# EAGLE schematic Sparkfun_LilyPad-Switched-Battery (EAGLE 7.5.0)
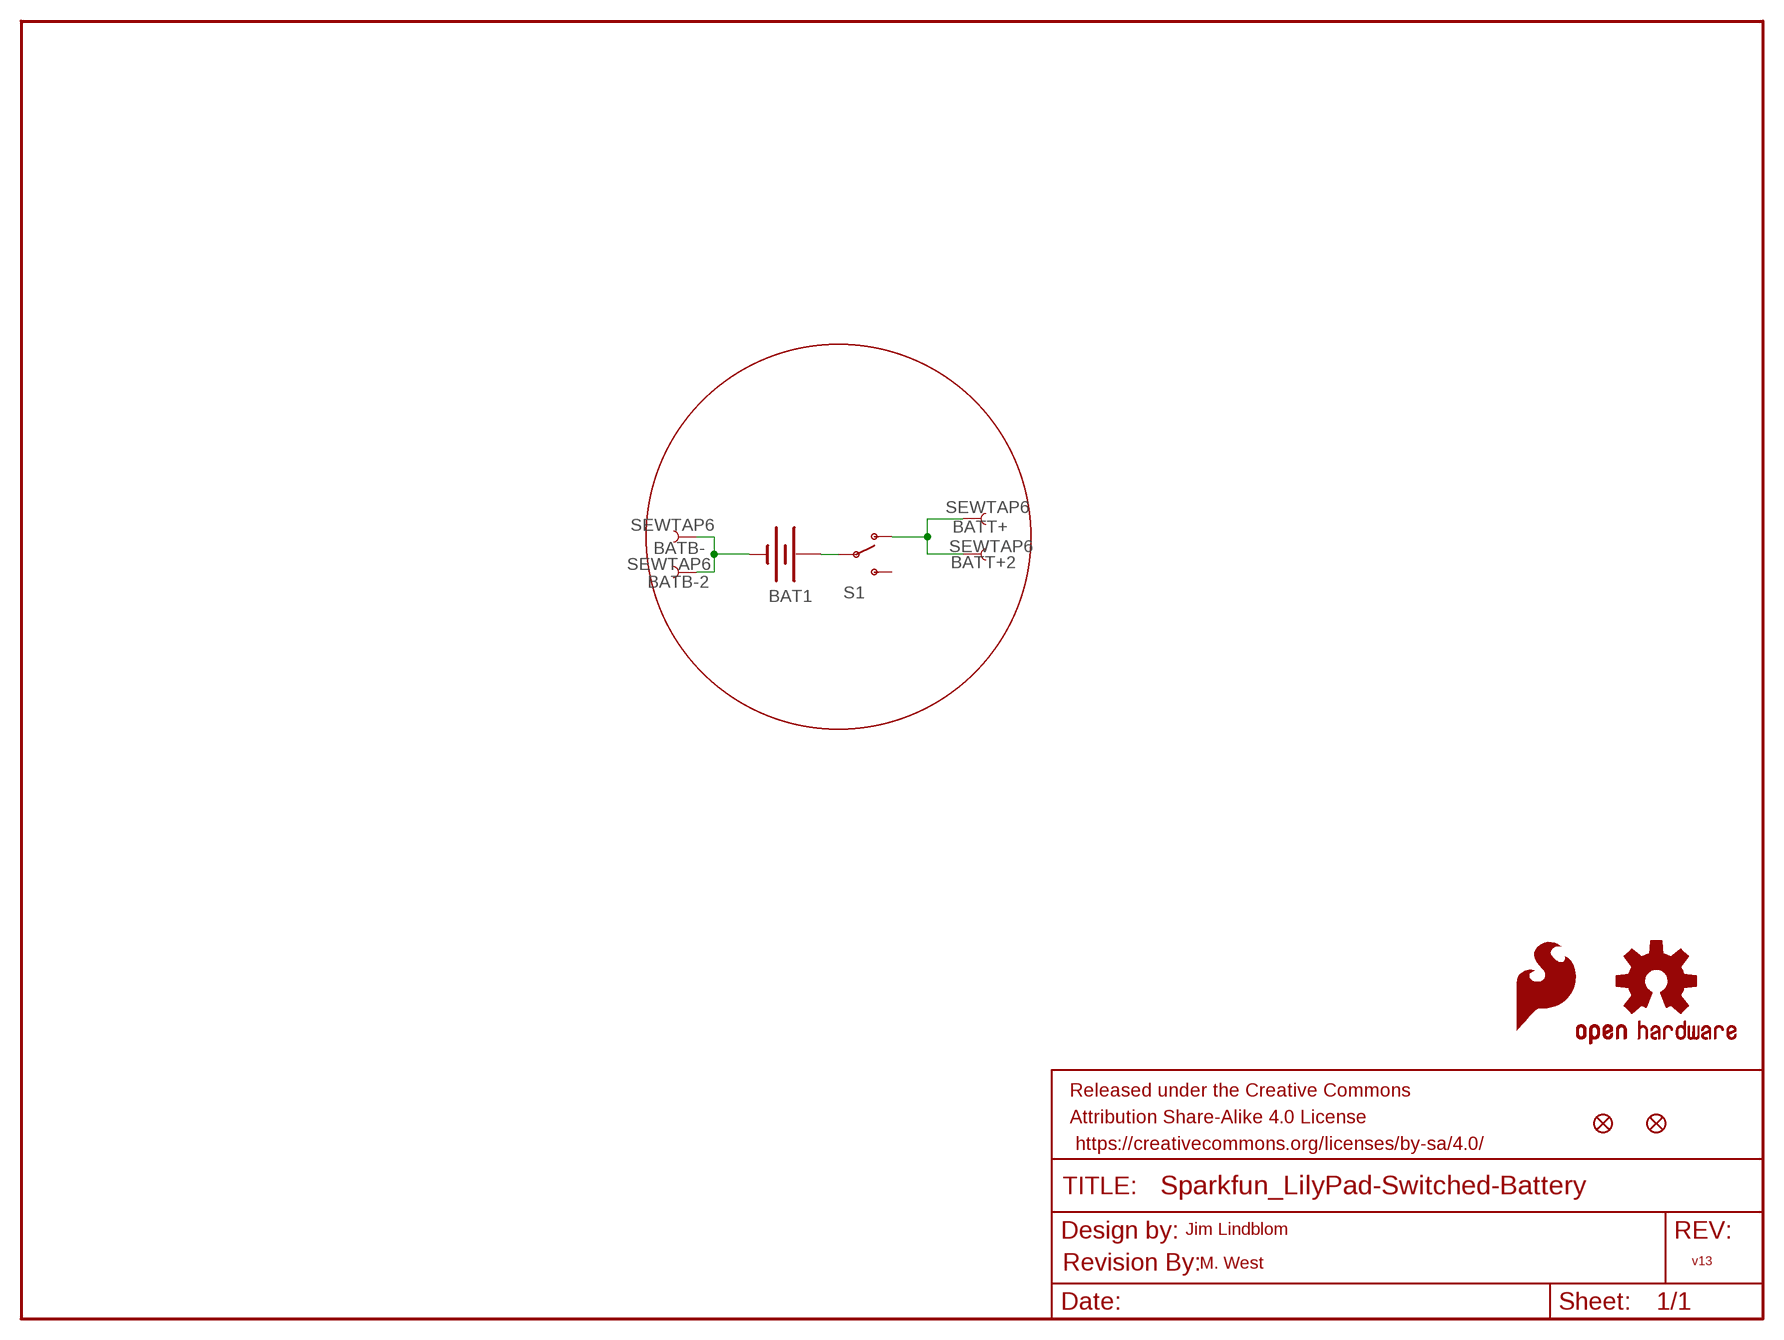
[diagram p0: schematic, sheet 1]

## Parts
BAT1  20mm coincell  BATTERY20MM_4LEGS  [BATTCON_20MM_4LEGS]
BATB-  SEWTAP6  [PETAL-SMALL-2SIDE]
BATB-2  SEWTAP6  [PETAL-SMALL-2SIDE]
BATT+  SEWTAP6  [PETAL-SMALL-2SIDE]
BATT+2  SEWTAP6  [PETAL-SMALL-2SIDE]
FD1  FIDUCIALUFIDUCIAL  [MICRO-FIDUCIAL]
FD2  FIDUCIALUFIDUCIAL  [MICRO-FIDUCIAL]
FRAME1  FRAME-LETTER  [CREATIVE_COMMONS]
LOGO1  SFE_LOGO_FLAME.1_INCH  [SFE_LOGO_FLAME_.1]
LOGO2  OSHW-LOGOS  [OSHW-LOGO-S]
S1  SWITCH-SPDTSMD  [AYZ0202]
U$1  REVISION  [REVISION]

## Nets
GND: BAT1.NEGATIVE(-) BATB-2.1 BATB-.1
N$1: BAT1.POSITIVE@1(+) BAT1.POSITIVE@2(+) BAT1.POSITIVE@3(+) BAT1.POSITIVE@4(+) S1.2(P)
N$2: BATT+2.1 BATT+.1 S1.1(O)
Unconnected: S1.3(S)

## Notes on the sheet
- Jim Lindblom
- v13
- M. West

## Library data of the parts
BAT1 = SparkFun-Electromechanical:BATTERY: Battery Holders Various common sizes : AA, AAA, 18650 (PRT-12895), 20mm coin cell and 12mm coin cell. 20MM_4LEGS, BATT-10373; PROD_ID: BATT-10373
BATB- BATB-2 BATT+ BATT+2 = LilyPad-Wearables:SEWTAP: Sew Taps for LilyPad Boards.
FD1 FD2 = SparkFun-Aesthetics:FIDUCIAL: Fiducial Alignment Points Various fiducial points for machine vision alignment.
FRAME1 = SparkFun-Aesthetics:FRAME-LETTER: Schematic Frame Standard 8.5x11 US Letter frame
LOGO1 = SparkFun-Aesthetics:SFE_LOGO_FLAME: SFE Logo, flame only This is the SparkFun flame logo. The logo on the schematic will always be the same size; the package variant is the height of the flame. Default layer for the logo on the board is tSilk.
LOGO2 = SparkFun-Aesthetics:OSHW-LOGO: Open Source Hardware Logo This logo indicates the piece of hardware it is found on incorporates a OSHW license and/or adheres to the definition of open source hardware found here: http://freedomdefined.org/OSHW
S1 = SparkFun-Electromechanical:SWITCH-SPDT: SPDT Switch Simple slide switch, Spark Fun Electronics SKU : COM-00102 DPDT SMT slide switch, AYZ0202, SWCH-08179; PROD_ID: SWCH-08179; SF_ID: COM-00597
U$1 = SparkFun-Aesthetics:REVISION

## Net classes
1 VCC: width 0.203 mm